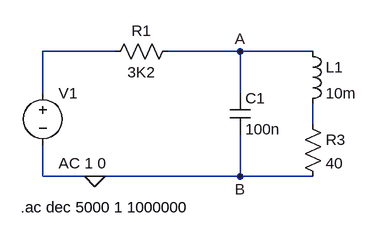
[diagram p0: schematic Draft1.asc]
Draft1.asc, the LTspice schematic file:
Version 4
SHEET 1 880 680
WIRE 64 48 -48 48
WIRE 256 48 144 48
WIRE 368 48 256 48
WIRE -48 112 -48 48
WIRE 256 112 256 48
WIRE 368 160 368 128
WIRE -48 240 -48 192
WIRE 32 240 -48 240
WIRE 256 240 256 176
WIRE 256 240 32 240
WIRE 368 240 256 240
FLAG 32 240 0
FLAG 256 48 A
FLAG 256 240 B
SYMBOL voltage -48 96 R0
WINDOW 123 24 124 Left 2
WINDOW 39 0 0 Left 2
SYMATTR InstName V1
SYMATTR Value ""
SYMATTR Value2 AC 1 0
SYMBOL res 160 32 R90
WINDOW 0 0 56 VBottom 2
WINDOW 3 32 56 VTop 2
SYMATTR InstName R1
SYMATTR Value 3K2
SYMBOL cap 240 112 R0
SYMATTR InstName C1
SYMATTR Value 100n
SYMBOL ind 352 32 R0
SYMATTR InstName L1
SYMATTR Value 10m
SYMBOL res 352 144 R0
SYMATTR InstName R3
SYMATTR Value 40
TEXT -82 288 Left 2 !.ac dec 5000 1 1000000

The netlist it stands for:
* Draft1.asc
V1 N001 0 AC 1 0
R1 A N001 3K2
C1 A 0 100n
L1 A N002 10m
R3 N002 0 40
.ac dec 5000 1 1000000
.backanno
.end